# Altium schematic sheet One-Wire_Write_Read.SchDoc: One-Wire Write/Read
size A4; DocumentNumber: 9; SheetNumber: 9; SheetTotal: 12
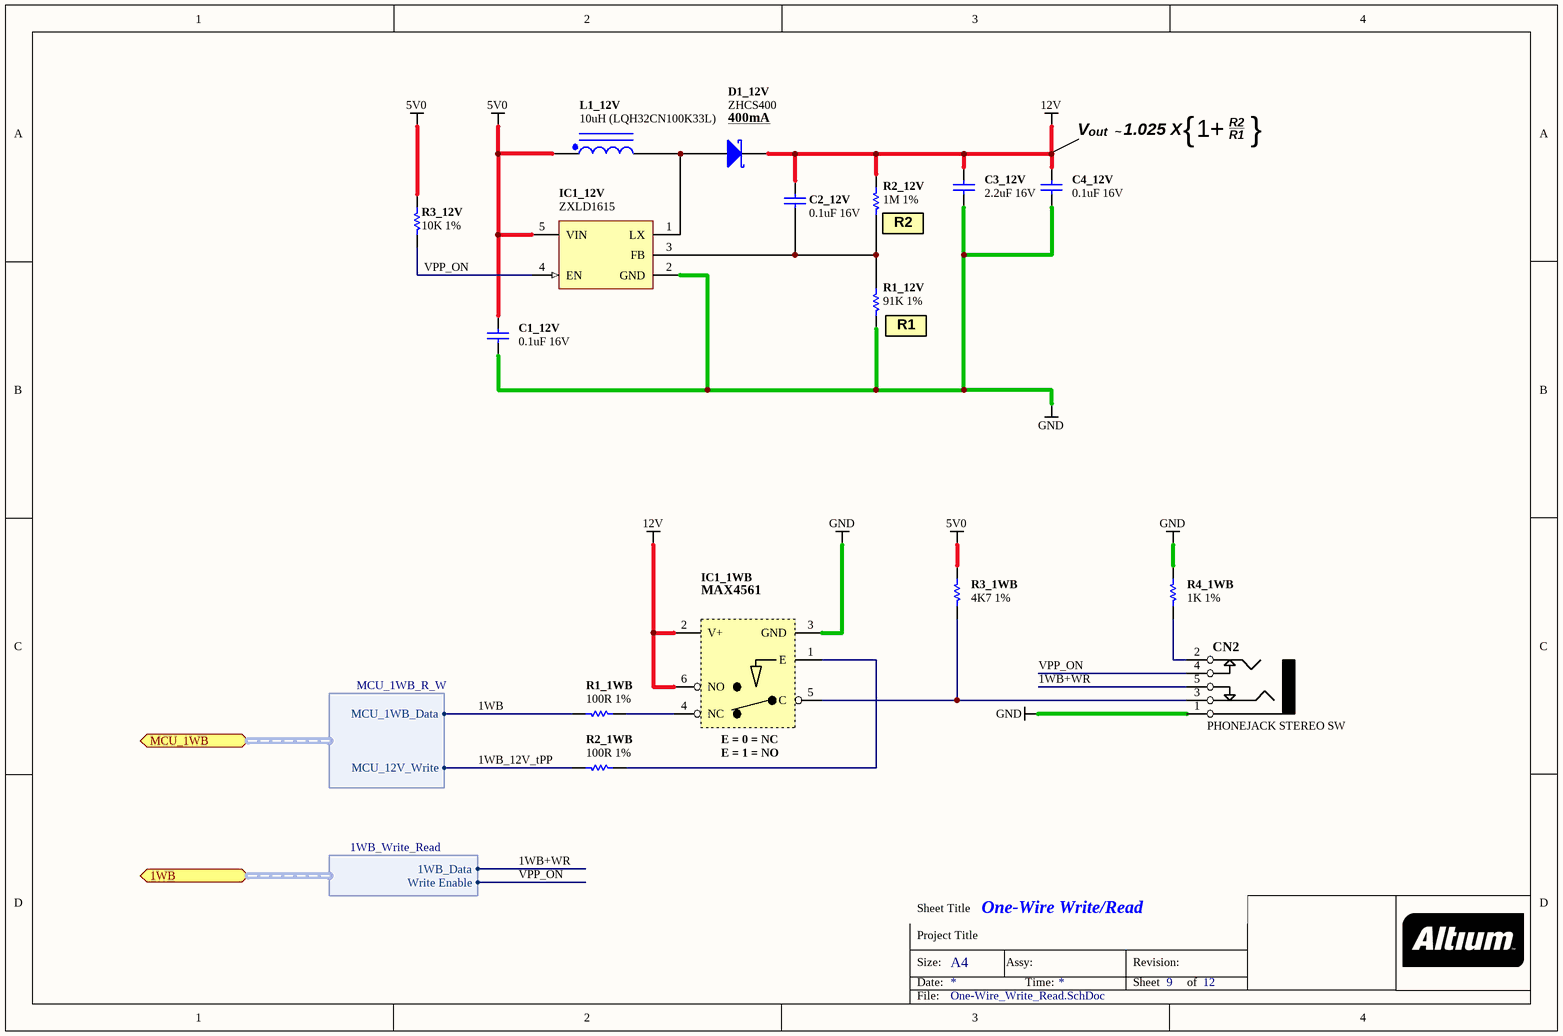
[diagram p0: One-Wire_Write_Read.SchDoc]

## Parts
C1_12V  0.1uF 16V  [CAPC1005-STAR]
C2_12V  0.1uF 16V  [CAPC1005-STAR]
C3_12V  2.2uF 16V  [CAPC2012-STAR]
C4_12V  0.1uF 16V  [CAPC1005-STAR]
CN2  PHONEJACK STEREO SW  [STX-2550-5N-TR]
D1_12V  ZHCS400  [SOD323]
IC1_1WB  MAX4561  [SOT23-6]
IC1_12V  ZXLD1615  [SOT-23-5]
L1_12V  10uH (LQH32CN100K33L)  [3261]
R1_1WB  100R 1%  [RESC1005-STAR]
R1_12V  91K 1%  [RESC1005-STAR]
R2_1WB  100R 1%  [RESC1005-STAR]
R2_12V  1M 1%  [RESC1005-STAR]
R3_1WB  4K7 1%  [RESC1005-STAR]
R3_12V  10K 1%  [RESC1005-STAR]
R4_1WB  1K 1%  [RESC1005-STAR]

## Ports
1WB (harness 1WB_Write_Read), MCU_1WB (harness MCU_1WB_R_W)

## Harnesses
1WB_Write_Read: 1WB_Data, Write Enable
MCU_1WB_R_W: MCU_1WB_Data, MCU_12V_Write

## Nets
5V0: C1_12V.2 IC1_12V.5(VIN) L1_12V.1 R3_1WB.2 R3_12V.1
12V: C2_12V.2 C3_12V.2 C4_12V.2 D1_12V.2(K) IC1_1WB.2(V+) IC1_1WB.6(NO) R2_12V.2
GND: C1_12V.1 C3_12V.1 C4_12V.1 CN2.1 IC1_1WB.3(GND) IC1_12V.2(GND) R1_12V.1 R4_1WB.2
1WB: R1_1WB.1 ; port MCU_1WB.MCU_1WB_Data
1WB+WR: CN2.5 ; port 1WB.1WB_Data
1WB_12V_tPP: R2_1WB.1 ; port MCU_1WB.MCU_12V_Write
VPP_ON: CN2.4 IC1_12V.4(EN) R3_12V.2 ; port 1WB.Write Enable
NetC2_12V_1: C2_12V.1 IC1_12V.3(FB) R1_12V.2 R2_12V.1
NetCN2_2: CN2.2 R4_1WB.1
NetCN2_3: CN2.3 IC1_1WB.5(C) R3_1WB.1
NetD1_12V_1: D1_12V.1(A) IC1_12V.1(LX) L1_12V.2
NetIC1_1WB_1: IC1_1WB.1(E) R2_1WB.2
NetIC1_1WB_4: IC1_1WB.4(NC) R1_1WB.2

## Notes on the sheet
- (near D1_12V) 400mA
- (near C4_12V) V
- out  ~
- 1.025 X
- {
- 1+
- R2
- R1
- }
- (near R2_12V) R2
- (near R1_12V) R1
- (near IC1_1WB) E = 0 = NC
- (near IC1_1WB) E = 1 = NO
- Sheet Title
- Project Title
- Size:
- Date:
- A4
- Assy:
- Time:
- Revision:
- Sheet
- of
- File:

## Library data of the parts
C1_12V C2_12V C4_12V = D-101-0080: Capacitor, Ceramic, 0.1uF 10% 16V 0402 (1005) X7R; Polarity: Non-Polarized; Capacitance: 0.1 uF; Dielectric: X7R; Mounting Technology: Surface Mount; Rated Voltage: 16 V; Status: Production; Technology: Ceramic; Tolerance: 10 %; Category: Capacitor
C3_12V = D-101-0000: Capacitor, Ceramic, 2.2uF 10% 16V 0805 (2012) X5R; Polarity: Non-Polarized; Capacitance: 2.2 uF; Dielectric: X5R; Mounting Technology: Surface Mount; Rated Voltage: 16 V; Status: Unreleased; Technology: Ceramic; Tolerance: 10 %; Category: Capacitor
CN2 = D-300-0059: Connector type: Header; Max Current: mA; Mounting Technology: Surface Mount; Status: Unreleased; Category: Connector
D1_12V = D-151-0004: Schottky Diode, 400mA; Rated Voltage: mV; Category: Diode-Schottky; Max Forward Current: 400 mA; Mounting Technology: Surface Mount; Status: Unreleased
IC1_1WB = D-200-0003: ±15kV ESD-Protected, Low-Voltage,  SPDT, CMOS Analog Switches; Supply Voltage: mV; Mounting Technology: Surface Mount; Status: Unreleased; Category: IC-Analog
IC1_12V = D-204-0017: ADJUSTABLE DC-DC BOOST CONVERTER WITH INTERNAL SWITCH IN  TSOT23-5; Max Input Voltage: 5.5 V; Max Output Current: 250 mA; Max Output Voltage: 28 V; Min Input Voltage: mV; Min Output Voltage: mV; Mounting Technology: Surface Mount; Status: Unreleased; Supply Voltage: mV; Category: IC-Power
L1_12V = D-102-0011: Inductor, 10uH, 450mA, 0.3R, 1210 (3225) LQH32CN100K33L; Category: Inductor; Inductance: 10 uH; Max Input Current: 450 mA; Mounting Technology: Surface Mount; Status: Production
R1_1WB R2_1WB = D-100-0131: Resistor, 100R 1% 0402 (1005); Power Rating: 63 mW; Category: Resistor; Mounting Technology: Surface Mount; Resistance: 100 R; Status: Production; Tolerance: 1 %
R1_12V = D-100-0073: Resistor, 91K 1% 0402; Power Rating: mW; Resistance: mR; Tolerance: %; Category: Resistor; Mounting Technology: Surface Mount; Status: Unreleased
R2_12V = D-100-0075: Resistor, 1M 1% 0402; Power Rating: mW; Resistance: mR; Tolerance: %; Category: Resistor; Mounting Technology: Surface Mount; Status: Unreleased
R3_1WB = D-100-0088: Resistor, 4K7 1% 0402 (1005); Power Rating: 63 mW; Resistance: 4.7 K; Category: Resistor; Mounting Technology: Surface Mount; Status: Production; Tolerance: 1 %
R3_12V = D-100-0130: Resistor, 10K 1% 0402 (1005); Power Rating: 63 mW; Category: Resistor; Mounting Technology: Surface Mount; Resistance: 10 K; Status: Production; Tolerance: 1 %
R4_1WB = D-100-0121: Resistor, 1K 1% 0402 (1005); Power Rating: 63 mW; Category: Resistor; Mounting Technology: Surface Mount; Resistance: 1 K; Status: Production; Tolerance: 1 %